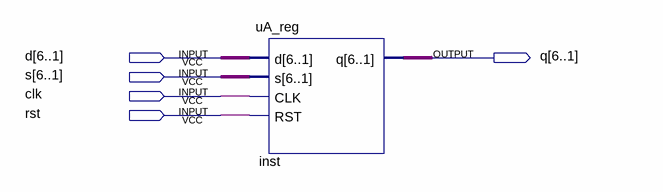
[diagram p0: schematic sheet]
// Quartus schematic reg6.bdf as structural Verilog: 1 symbols, 5 pins
module reg6 (
  input  [6:1] d,
  input  [6:1] s,
  input  clk,
  input  rst,
  output [6:1] q
);

  uA_reg inst (.d(d), .s(s), .CLK(clk), .RST(rst), .q(q));
endmodule
